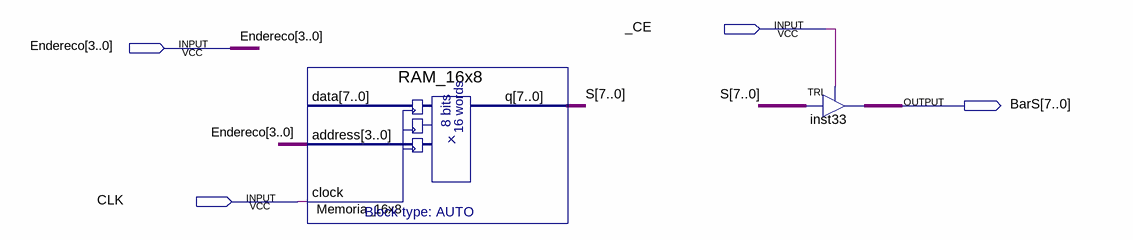
[diagram p0: schematic sheet]
// Quartus schematic Memoria_16x8.bdf as structural Verilog: 2 symbols, 4 pins
module Memoria_16x8 (
  input  _CE,
  input  [3:0] Endereco,
  input  CLK,
  output [7:0] BarS
);

  wire [7:0] S;

  RAM_16x8 Memoria_16x8 (.address(Endereco), .clock(CLK), .q(S));  // open: data
  TRI inst33[7:0] (.IN(S), .OE(_CE), .OUT(BarS));
endmodule
